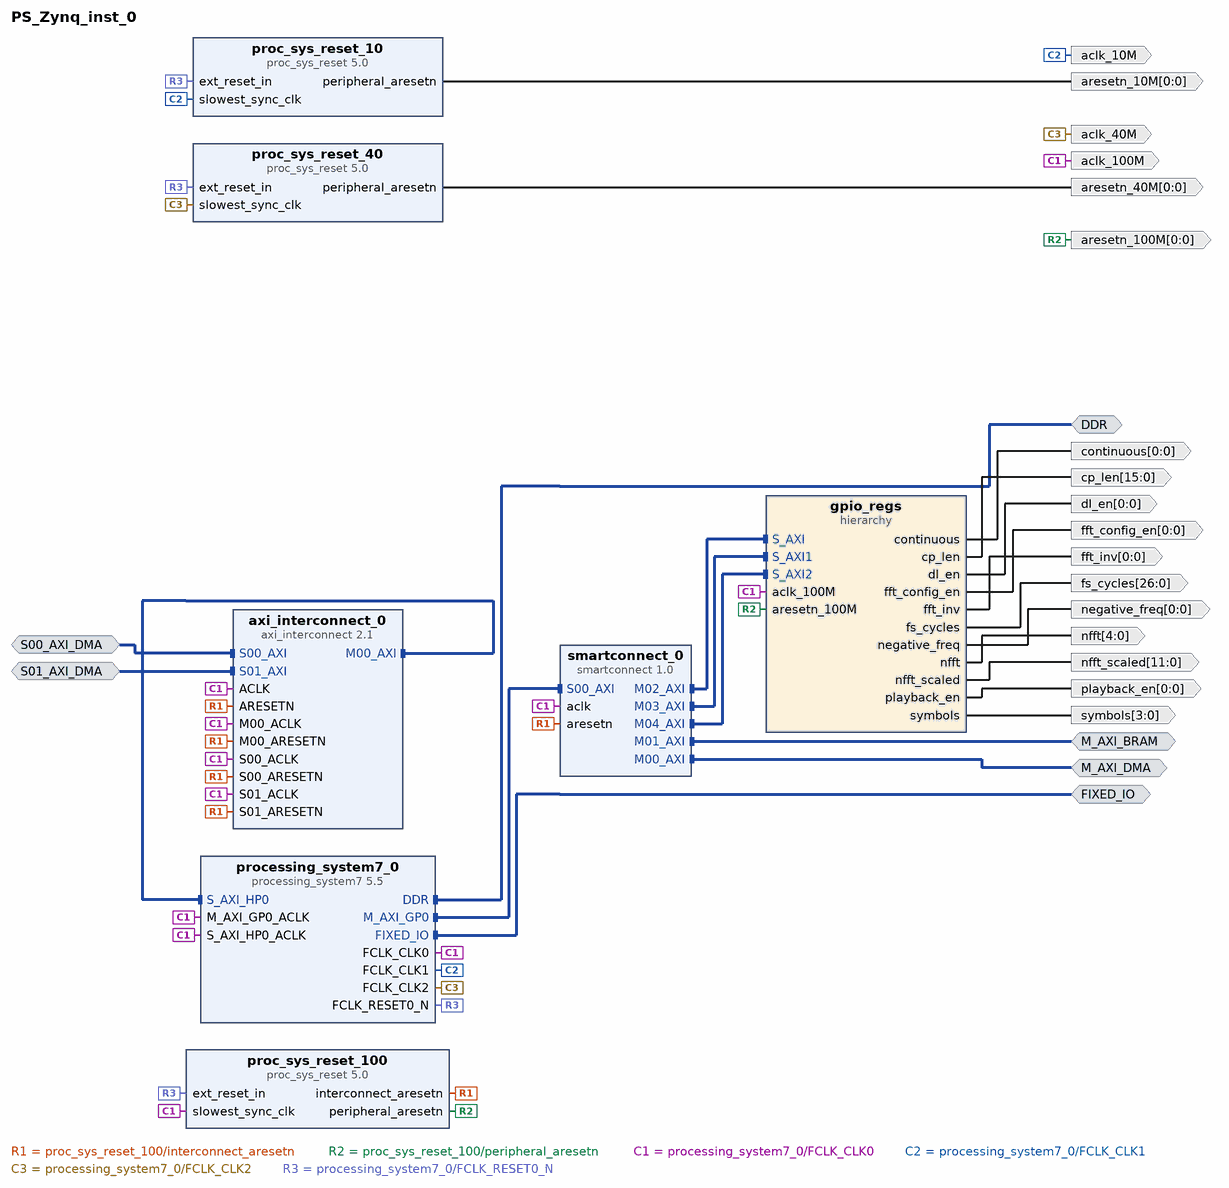
[diagram p0: block diagram of the top level]
# Vivado block design PS_Zynq_inst_0, xc7z020clg400-1, Vivado 2022.1
create_bd_design PS_Zynq_inst_0

create_bd_intf_port -mode Master -vlnv xilinx.com:interface:aximm_rtl:1.0 M_AXI_DMA
create_bd_intf_port -mode Slave -vlnv xilinx.com:interface:aximm_rtl:1.0 S00_AXI_DMA
create_bd_intf_port -mode Slave -vlnv xilinx.com:interface:aximm_rtl:1.0 S01_AXI_DMA
create_bd_intf_port -mode Master -vlnv xilinx.com:interface:ddrx_rtl:1.0 DDR
create_bd_intf_port -mode Master -vlnv xilinx.com:display_processing_system7:fixedio_rtl:1.0 FIXED_IO
create_bd_intf_port -mode Master -vlnv xilinx.com:interface:aximm_rtl:1.0 M_AXI_BRAM
create_bd_port -dir O -type clk aclk_100M
create_bd_port -dir O -type clk aclk_10M
create_bd_port -dir O -type clk aclk_40M
create_bd_port -dir O -from 0 -to 0 -type rst aresetn_40M
create_bd_port -dir O -from 0 -to 0 -type rst aresetn_10M
create_bd_port -dir O -from 0 -to 0 -type rst aresetn_100M
create_bd_port -dir O -from 26 -to 0 fs_cycles
create_bd_port -dir O -from 4 -to 0 nfft
create_bd_port -dir O -from 15 -to 0 cp_len
create_bd_port -dir O -from 11 -to 0 nfft_scaled
create_bd_port -dir O -from 3 -to 0 symbols
create_bd_port -dir O -from 0 -to 0 fft_inv
create_bd_port -dir O -from 0 -to 0 negative_freq
create_bd_port -dir O -from 0 -to 0 continuous
create_bd_port -dir O -from 0 -to 0 dl_en
create_bd_port -dir O -from 0 -to 0 playback_en
create_bd_port -dir O -from 0 -to 0 fft_config_en

create_bd_cell -type ip -vlnv xilinx.com:ip:processing_system7:5.5 processing_system7_0
set_property -dict [list \
  CONFIG.PCW_APU_PERIPHERAL_FREQMHZ 650 \
  CONFIG.PCW_CRYSTAL_PERIPHERAL_FREQMHZ 50 \
  CONFIG.PCW_ENET0_ENET0_IO {MIO 16 .. 27} \
  CONFIG.PCW_ENET0_GRP_MDIO_ENABLE 1 \
  CONFIG.PCW_ENET0_GRP_MDIO_IO {MIO 52 .. 53} \
  CONFIG.PCW_ENET0_PERIPHERAL_ENABLE 1 \
  CONFIG.PCW_ENET0_RESET_ENABLE 1 \
  CONFIG.PCW_ENET0_RESET_IO {MIO 9} \
  CONFIG.PCW_ENET_RESET_ENABLE 1 \
  CONFIG.PCW_ENET_RESET_SELECT {Share reset pin} \
  CONFIG.PCW_EN_CLK1_PORT 1 \
  CONFIG.PCW_EN_CLK2_PORT 1 \
  CONFIG.PCW_FCLK_CLK1_BUF TRUE \
  CONFIG.PCW_FCLK_CLK2_BUF TRUE \
  CONFIG.PCW_FPGA0_PERIPHERAL_FREQMHZ 100 \
  CONFIG.PCW_FPGA1_PERIPHERAL_FREQMHZ 10 \
  CONFIG.PCW_FPGA2_PERIPHERAL_FREQMHZ 40 \
  CONFIG.PCW_FPGA_FCLK1_ENABLE 1 \
  CONFIG.PCW_FPGA_FCLK2_ENABLE 1 \
  CONFIG.PCW_GPIO_MIO_GPIO_ENABLE 1 \
  CONFIG.PCW_GPIO_MIO_GPIO_IO MIO \
  CONFIG.PCW_I2C_RESET_ENABLE 1 \
  CONFIG.PCW_M_AXI_GP0_FREQMHZ 10 \
  CONFIG.PCW_PERIPHERAL_BOARD_PRESET None \
  CONFIG.PCW_PRESET_BANK1_VOLTAGE {LVCMOS 1.8V} \
  CONFIG.PCW_QSPI_GRP_FBCLK_ENABLE 1 \
  CONFIG.PCW_QSPI_GRP_FBCLK_IO {MIO 8} \
  CONFIG.PCW_QSPI_GRP_SINGLE_SS_ENABLE 1 \
  CONFIG.PCW_QSPI_GRP_SINGLE_SS_IO {MIO 1 .. 6} \
  CONFIG.PCW_QSPI_PERIPHERAL_ENABLE 1 \
  CONFIG.PCW_QSPI_QSPI_IO {MIO 1 .. 6} \
  CONFIG.PCW_SD0_GRP_CD_ENABLE 1 \
  CONFIG.PCW_SD0_GRP_CD_IO {MIO 47} \
  CONFIG.PCW_SD0_GRP_WP_ENABLE 0 \
  CONFIG.PCW_SD0_PERIPHERAL_ENABLE 1 \
  CONFIG.PCW_SD0_SD0_IO {MIO 40 .. 45} \
  CONFIG.PCW_SDIO_PERIPHERAL_FREQMHZ 50 \
  CONFIG.PCW_SINGLE_QSPI_DATA_MODE x4 \
  CONFIG.PCW_S_AXI_HP0_FREQMHZ 10 \
  CONFIG.PCW_UART0_PERIPHERAL_ENABLE 1 \
  CONFIG.PCW_UART0_UART0_IO {MIO 14 .. 15} \
  CONFIG.PCW_UART1_PERIPHERAL_ENABLE 0 \
  CONFIG.PCW_UART_PERIPHERAL_FREQMHZ 100 \
  CONFIG.PCW_UIPARAM_DDR_BUS_WIDTH {16 Bit} \
  CONFIG.PCW_UIPARAM_DDR_FREQ_MHZ 525 \
  CONFIG.PCW_UIPARAM_DDR_PARTNO {MT41J256M16 RE-125} \
  CONFIG.PCW_USB0_PERIPHERAL_ENABLE 1 \
  CONFIG.PCW_USB0_RESET_ENABLE 1 \
  CONFIG.PCW_USB0_RESET_IO {MIO 46} \
  CONFIG.PCW_USB0_USB0_IO {MIO 28 .. 39} \
  CONFIG.PCW_USB_RESET_ENABLE 1 \
  CONFIG.PCW_USB_RESET_SELECT {Share reset pin} \
  CONFIG.PCW_USE_S_AXI_HP0 1 \
] [get_bd_cells processing_system7_0]
# 495 more settings of processing_system7_0 are not shown: defaults, MIO pin electricals, DDR timing, and values the tool derives
create_bd_cell -type ip -vlnv xilinx.com:ip:proc_sys_reset:5.0 proc_sys_reset_100
create_bd_cell -type ip -vlnv xilinx.com:ip:smartconnect:1.0 smartconnect_0
set_property -dict {CONFIG.NUM_MI 5 CONFIG.NUM_SI 1} [get_bd_cells smartconnect_0]
create_bd_cell -type ip -vlnv xilinx.com:ip:axi_interconnect:2.1 axi_interconnect_0
set_property -dict {CONFIG.NUM_MI 1 CONFIG.NUM_SI 2} [get_bd_cells axi_interconnect_0]
create_bd_cell -type ip -vlnv xilinx.com:ip:proc_sys_reset:5.0 proc_sys_reset_10
create_bd_cell -type ip -vlnv xilinx.com:ip:proc_sys_reset:5.0 proc_sys_reset_40
create_bd_cell -type hier gpio_regs

# ---- hierarchy /gpio_regs ----
current_bd_instance /gpio_regs
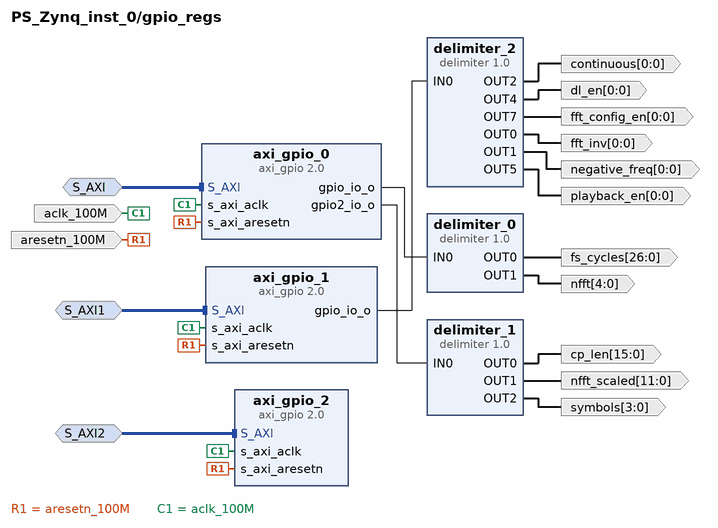
[diagram p1: block diagram inside /gpio_regs]
create_bd_intf_pin -mode Slave -vlnv xilinx.com:interface:aximm_rtl:1.0 S_AXI
create_bd_intf_pin -mode Slave -vlnv xilinx.com:interface:aximm_rtl:1.0 S_AXI1
create_bd_intf_pin -mode Slave -vlnv xilinx.com:interface:aximm_rtl:1.0 S_AXI2
create_bd_pin -dir I -type clk aclk_100M
create_bd_pin -dir I -type rst aresetn_100M
create_bd_pin -dir O -from 15 -to 0 cp_len
create_bd_pin -dir O -from 11 -to 0 nfft_scaled
create_bd_pin -dir O -from 3 -to 0 symbols
create_bd_pin -dir O -from 26 -to 0 fs_cycles
create_bd_pin -dir O -from 4 -to 0 nfft
create_bd_pin -dir O -from 0 -to 0 fft_inv
create_bd_pin -dir O -from 0 -to 0 negative_freq
create_bd_pin -dir O -from 0 -to 0 continuous
create_bd_pin -dir O -from 0 -to 0 dl_en
create_bd_pin -dir O -from 0 -to 0 playback_en
create_bd_pin -dir O -from 0 -to 0 fft_config_en

create_bd_cell -type ip -vlnv xilinx.com:ip:axi_gpio:2.0 axi_gpio_0
set_property -dict {CONFIG.C_ALL_OUTPUTS 1 CONFIG.C_ALL_OUTPUTS_2 1 CONFIG.C_IS_DUAL 1} [get_bd_cells axi_gpio_0]
create_bd_cell -type ip -vlnv xilinx.com:ip:axi_gpio:2.0 axi_gpio_1
set_property -dict [list \
  CONFIG.C_ALL_OUTPUTS 1 \
  CONFIG.C_ALL_OUTPUTS_2 1 \
  CONFIG.C_GPIO_WIDTH 18 \
  CONFIG.C_IS_DUAL 1 \
] [get_bd_cells axi_gpio_1]
create_bd_cell -type ip -vlnv user.org:user:delimiter:1.0 delimiter_1
set_property -dict [list \
  CONFIG.IN0_WIDTH 32 \
  CONFIG.NUM_OUTPUTS 3 \
  CONFIG.OUT0_WIDTH 16 \
  CONFIG.OUT1_WIDTH 12 \
  CONFIG.OUT2_WIDTH 4 \
] [get_bd_cells delimiter_1]
create_bd_cell -type ip -vlnv xilinx.com:ip:axi_gpio:2.0 axi_gpio_2
set_property -dict {CONFIG.C_ALL_OUTPUTS 1 CONFIG.C_ALL_OUTPUTS_2 1 CONFIG.C_IS_DUAL 1} [get_bd_cells axi_gpio_2]
create_bd_cell -type ip -vlnv user.org:user:delimiter:1.0 delimiter_2
set_property -dict [list \
  CONFIG.IN0_WIDTH 18 \
  CONFIG.NUM_OUTPUTS 8 \
  CONFIG.OUT0_WIDTH 1 \
  CONFIG.OUT2_WIDTH 1 \
  CONFIG.OUT3_WIDTH 5 \
  CONFIG.OUT4_WIDTH 1 \
  CONFIG.OUT5_WIDTH 1 \
  CONFIG.OUT6_WIDTH 7 \
  CONFIG.OUT7_WIDTH 1 \
] [get_bd_cells delimiter_2]
create_bd_cell -type ip -vlnv user.org:user:delimiter:1.0 delimiter_0
set_property -dict {CONFIG.IN0_WIDTH 32 CONFIG.OUT0_WIDTH 27 CONFIG.OUT1_WIDTH 5} [get_bd_cells delimiter_0]

# ---- connections ----

current_bd_instance /gpio_regs
connect_bd_intf_net -intf_net smartconnect_0_M02_AXI [get_bd_intf_pins S_AXI] [get_bd_intf_pins axi_gpio_0/S_AXI]
connect_bd_intf_net -intf_net smartconnect_0_M03_AXI [get_bd_intf_pins S_AXI1] [get_bd_intf_pins axi_gpio_1/S_AXI]
connect_bd_intf_net -intf_net smartconnect_0_M04_AXI [get_bd_intf_pins S_AXI2] [get_bd_intf_pins axi_gpio_2/S_AXI]
connect_bd_net [get_bd_pins axi_gpio_0/gpio2_io_o] [get_bd_pins delimiter_1/IN0]
connect_bd_net [get_bd_pins axi_gpio_0/gpio_io_o] [get_bd_pins delimiter_0/IN0]
connect_bd_net [get_bd_pins axi_gpio_1/gpio_io_o] [get_bd_pins delimiter_2/IN0]
connect_bd_net [get_bd_pins delimiter_0/OUT0] [get_bd_pins fs_cycles]
connect_bd_net [get_bd_pins delimiter_0/OUT1] [get_bd_pins nfft]
connect_bd_net [get_bd_pins delimiter_1/OUT0] [get_bd_pins cp_len]
connect_bd_net [get_bd_pins delimiter_1/OUT1] [get_bd_pins nfft_scaled]
connect_bd_net [get_bd_pins delimiter_1/OUT2] [get_bd_pins symbols]
connect_bd_net [get_bd_pins delimiter_2/OUT0] [get_bd_pins fft_inv]
connect_bd_net [get_bd_pins delimiter_2/OUT1] [get_bd_pins negative_freq]
connect_bd_net [get_bd_pins delimiter_2/OUT2] [get_bd_pins continuous]
connect_bd_net [get_bd_pins delimiter_2/OUT4] [get_bd_pins dl_en]
connect_bd_net [get_bd_pins delimiter_2/OUT5] [get_bd_pins playback_en]
connect_bd_net [get_bd_pins delimiter_2/OUT7] [get_bd_pins fft_config_en]
connect_bd_net -net proc_sys_reset_100_peripheral_aresetn [get_bd_pins aresetn_100M] \
  [get_bd_pins axi_gpio_1/s_axi_aresetn] [get_bd_pins axi_gpio_2/s_axi_aresetn] [get_bd_pins axi_gpio_0/s_axi_aresetn]
connect_bd_net -net processing_system7_0_FCLK_CLK1 [get_bd_pins aclk_100M] \
  [get_bd_pins axi_gpio_1/s_axi_aclk] [get_bd_pins axi_gpio_2/s_axi_aclk] [get_bd_pins axi_gpio_0/s_axi_aclk]

current_bd_instance /
connect_bd_intf_net -intf_net S00_AXI_0_1 [get_bd_intf_ports S00_AXI_DMA] [get_bd_intf_pins axi_interconnect_0/S00_AXI]
connect_bd_intf_net -intf_net S01_AXI_0_1 [get_bd_intf_ports S01_AXI_DMA] [get_bd_intf_pins axi_interconnect_0/S01_AXI]
connect_bd_intf_net [get_bd_intf_pins axi_interconnect_0/M00_AXI] [get_bd_intf_pins processing_system7_0/S_AXI_HP0]
connect_bd_intf_net [get_bd_intf_ports DDR] [get_bd_intf_pins processing_system7_0/DDR]
connect_bd_intf_net [get_bd_intf_ports FIXED_IO] [get_bd_intf_pins processing_system7_0/FIXED_IO]
connect_bd_intf_net [get_bd_intf_pins processing_system7_0/M_AXI_GP0] [get_bd_intf_pins smartconnect_0/S00_AXI]
connect_bd_intf_net [get_bd_intf_ports M_AXI_DMA] [get_bd_intf_pins smartconnect_0/M00_AXI]
connect_bd_intf_net [get_bd_intf_ports M_AXI_BRAM] [get_bd_intf_pins smartconnect_0/M01_AXI]
connect_bd_intf_net [get_bd_intf_pins gpio_regs/S_AXI] [get_bd_intf_pins smartconnect_0/M02_AXI]
connect_bd_intf_net [get_bd_intf_pins smartconnect_0/M03_AXI] [get_bd_intf_pins gpio_regs/S_AXI1]
connect_bd_intf_net [get_bd_intf_pins smartconnect_0/M04_AXI] [get_bd_intf_pins gpio_regs/S_AXI2]
connect_bd_net -net delimiter_0_OUT0 [get_bd_pins gpio_regs/fs_cycles] [get_bd_ports fs_cycles]
connect_bd_net -net delimiter_0_OUT1 [get_bd_pins gpio_regs/nfft] [get_bd_ports nfft]
connect_bd_net -net delimiter_1_OUT0 [get_bd_pins gpio_regs/cp_len] [get_bd_ports cp_len]
connect_bd_net -net delimiter_1_OUT1 [get_bd_pins gpio_regs/nfft_scaled] [get_bd_ports nfft_scaled]
connect_bd_net -net delimiter_1_OUT2 [get_bd_pins gpio_regs/symbols] [get_bd_ports symbols]
connect_bd_net -net gpio_regs_OUT0_0 [get_bd_pins gpio_regs/fft_inv] [get_bd_ports fft_inv]
connect_bd_net -net gpio_regs_OUT1_0 [get_bd_pins gpio_regs/negative_freq] [get_bd_ports negative_freq]
connect_bd_net -net gpio_regs_OUT2_0 [get_bd_pins gpio_regs/continuous] [get_bd_ports continuous]
connect_bd_net -net gpio_regs_OUT4_0 [get_bd_pins gpio_regs/dl_en] [get_bd_ports dl_en]
connect_bd_net -net gpio_regs_OUT5_0 [get_bd_pins gpio_regs/playback_en] [get_bd_ports playback_en]
connect_bd_net -net gpio_regs_OUT7_0 [get_bd_pins gpio_regs/fft_config_en] [get_bd_ports fft_config_en]
connect_bd_net -net proc_sys_reset_0_interconnect_aresetn [get_bd_pins proc_sys_reset_100/interconnect_aresetn] \
  [get_bd_pins smartconnect_0/aresetn] [get_bd_pins axi_interconnect_0/ARESETN] [get_bd_pins axi_interconnect_0/S00_ARESETN] \
  [get_bd_pins axi_interconnect_0/M00_ARESETN] [get_bd_pins axi_interconnect_0/S01_ARESETN]
connect_bd_net [get_bd_pins proc_sys_reset_100/peripheral_aresetn] [get_bd_ports aresetn_100M] [get_bd_pins gpio_regs/aresetn_100M]
connect_bd_net [get_bd_pins proc_sys_reset_10/peripheral_aresetn] [get_bd_ports aresetn_10M]
connect_bd_net [get_bd_pins proc_sys_reset_40/peripheral_aresetn] [get_bd_ports aresetn_40M]
connect_bd_net [get_bd_pins processing_system7_0/FCLK_CLK0] \
  [get_bd_ports aclk_100M] [get_bd_pins processing_system7_0/M_AXI_GP0_ACLK] \
  [get_bd_pins proc_sys_reset_100/slowest_sync_clk] [get_bd_pins smartconnect_0/aclk] [get_bd_pins axi_interconnect_0/ACLK] \
  [get_bd_pins axi_interconnect_0/S00_ACLK] [get_bd_pins axi_interconnect_0/M00_ACLK] \
  [get_bd_pins axi_interconnect_0/S01_ACLK] [get_bd_pins processing_system7_0/S_AXI_HP0_ACLK] \
  [get_bd_pins gpio_regs/aclk_100M]
connect_bd_net [get_bd_pins processing_system7_0/FCLK_CLK1] [get_bd_ports aclk_10M] [get_bd_pins proc_sys_reset_10/slowest_sync_clk]
connect_bd_net [get_bd_pins processing_system7_0/FCLK_CLK2] [get_bd_ports aclk_40M] [get_bd_pins proc_sys_reset_40/slowest_sync_clk]
connect_bd_net [get_bd_pins processing_system7_0/FCLK_RESET0_N] \
  [get_bd_pins proc_sys_reset_100/ext_reset_in] [get_bd_pins proc_sys_reset_10/ext_reset_in] \
  [get_bd_pins proc_sys_reset_40/ext_reset_in]

# ---- address map ----
assign_bd_address -offset 0x40000000 -range 128 -target_address_space [get_bd_addr_spaces processing_system7_0/Data] [get_bd_addr_segs M_AXI_DMA/Reg]
assign_bd_address -offset 0x40010000 -range 128 -target_address_space [get_bd_addr_spaces processing_system7_0/Data] [get_bd_addr_segs gpio_regs/axi_gpio_0/S_AXI/Reg]
assign_bd_address -offset 0x40010100 -range 128 -target_address_space [get_bd_addr_spaces processing_system7_0/Data] [get_bd_addr_segs gpio_regs/axi_gpio_1/S_AXI/Reg]
assign_bd_address -offset 0x40010200 -range 128 -target_address_space [get_bd_addr_spaces processing_system7_0/Data] [get_bd_addr_segs gpio_regs/axi_gpio_2/S_AXI/Reg]
assign_bd_address -offset 0x40020000 -range 16K -target_address_space [get_bd_addr_spaces processing_system7_0/Data] [get_bd_addr_segs M_AXI_BRAM/Reg]
assign_bd_address -offset 0x00000000 -range 512M -target_address_space [get_bd_addr_spaces S00_AXI_DMA] [get_bd_addr_segs processing_system7_0/S_AXI_HP0/HP0_DDR_LOWOCM]
assign_bd_address -offset 0x00000000 -range 512M -target_address_space [get_bd_addr_spaces S01_AXI_DMA] [get_bd_addr_segs processing_system7_0/S_AXI_HP0/HP0_DDR_LOWOCM]

validate_bd_design
save_bd_design
